# EAGLE design CAM_Board_v1 (EAGLE 9.6.2)
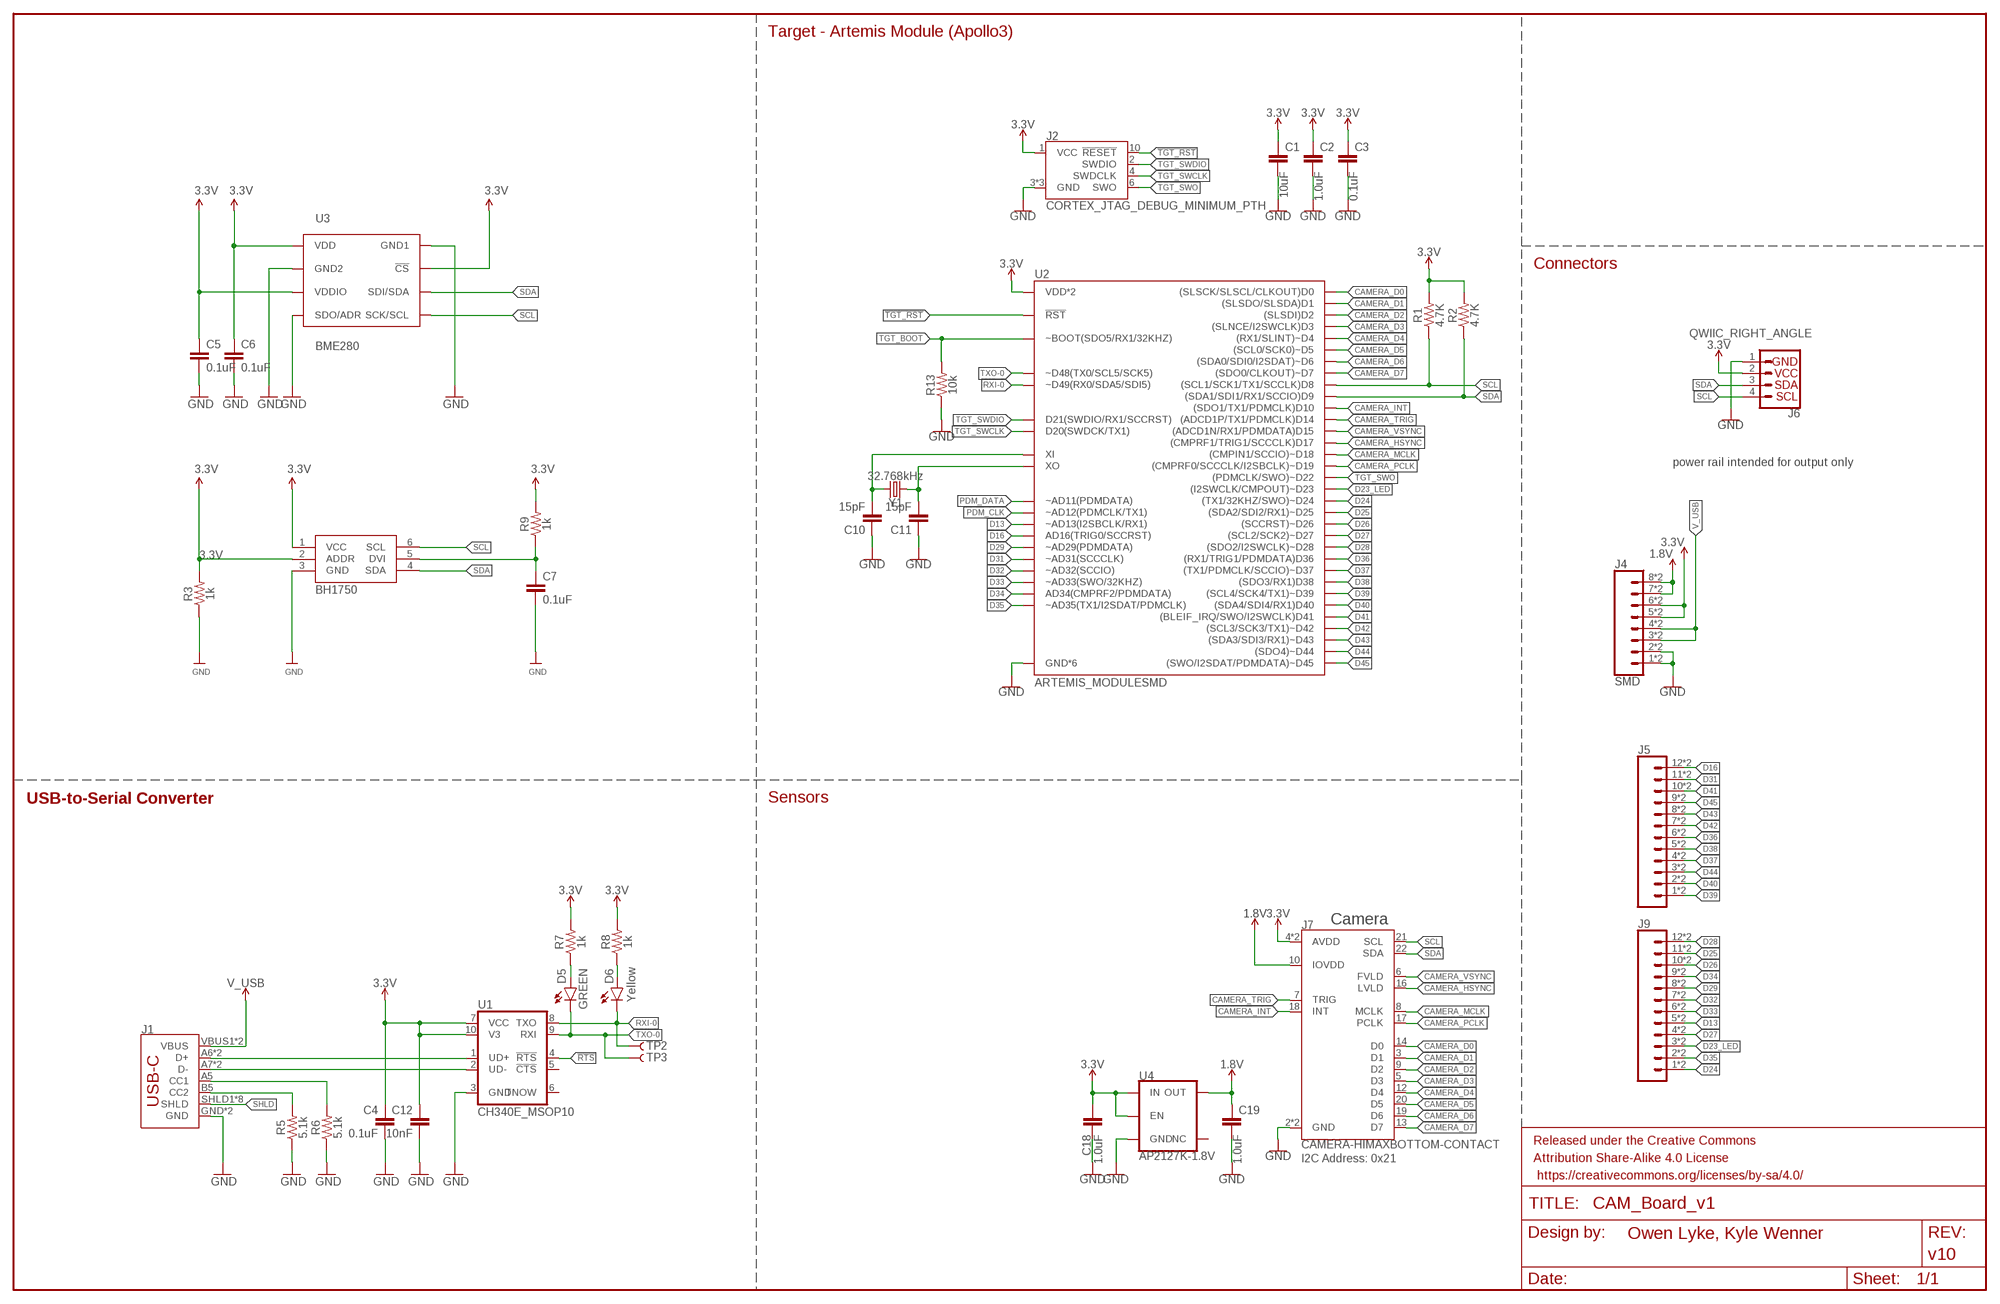
[diagram p0: schematic, sheet 1]

## Parts
C1  10uF  10UF-0603-6.3V-20%  [0603]
C2  1.0uF  1.0UF-0603-16V-10%  [0603]
C3  0.1uF  0.1UF-0603-25V-5%  [0603]
C4  0.1uF  0.1UF-0603-25V-(+80/-20%)  [0603]
C5  0.1uF  0.1UF-25V-5%(0603)  [0603-CAP]
C6  0.1uF  0.1UF-25V-5%(0603)  [0603-CAP]
C7  0.1uF  0.1UF-25V-5%(0603)  [0603-CAP]
C10  15pF  15PF-0603-50V-5%  [0603]
C11  15pF  15PF-0603-50V-5%  [0603]
C12  10nF  10NF-0603-50V-10%  [0603]
C18  1.0uF  1.0UF-0603-16V-10%  [0603]
C19  1.0uF  1.0UF-0603-16V-10%  [0603]
D5  GREEN  LED-GREEN0603  [LED-0603]
D6  Yellow  LED-YELLOW0603  [LED-0603]
FRAME1  FRAME-LEDGER  [CREATIVE_COMMONS]
IC1  BH1750  [WSOF-6]
J1  USB-C  USB_C2-LAYER  [USB-C-16P]
J2  CORTEX_JTAG_DEBUG_MINIMUM_PTH  [2X5-PTH-1.27MM]
J4  SMD  CONN_08SMD-COMBO-FEMALE  [1X08_SMD_COMBINED]
J5  CONN_12SMD_COMBINED  [1X12_SMD_COMBINED]
J6  QWIIC_RIGHT_ANGLE  QWIIC_CONNECTORJS-1MM  [JST04_1MM_RA]
J7  CAMERA-HIMAXBOTTOM-CONTACT  [FPC-24-AMPHENOL-SFV24R-1STE1HLF]
J9  CONN_12SMD_COMBINED  [1X12_SMD_COMBINED]
R1  4.7K  10KOHM-0603-1/10W-1%  [0603@1]
R2  4.7K  10KOHM-0603-1/10W-1%  [0603@1]
R3  1k  1KOHM-0603-1/10W-1%  [0603@1]
R5  5.1k  5.1KOHM5.1KOHM-0603-1/10W-1%  [0603@1]
R6  5.1k  5.1KOHM5.1KOHM-0603-1/10W-1%  [0603@1]
R7  1k  1KOHM-0603-1/10W-1%  [0603@1]
R8  1k  1KOHM-0603-1/10W-1%  [0603@1]
R9  1k  1KOHM-0603-1/10W-1%  [0603@1]
R13  10k  10KOHM-0603-1/10W-1%  [0603@1]
TP2  TEST-POINTTP_15TH_THRU  [TP_15TH]
TP3  TEST-POINTTP_15TH_THRU  [TP_15TH]
U1  CH340E_MSOP10  [MSOP10]
U2  ARTEMIS_MODULESMD  [ARTEMIS_FP]
U3  BME280  [BME280_LGA]
U4  AP2127K-1.8V  V_REG_AP2127K-1.8V  [SOT23-5]
Y1  32.768kHz  CRYSTAL-32.768KHZSMD-3.2X1.5  [CRYSTAL-SMD-3.2X1.5MM]

## Nets
1.8V: C19.1 J4.7 J4.7@2 J4.8 J4.8@2 J7.10(IOVDD) U4.5(OUT)
3.3V: C1.1 C2.1 C3.1 C4.1 C5.1 C6.1 C12.1 C18.1 IC1.1(VCC) IC1.2(ADDR) J2.1(VCC) J4.5 J4.5@2 J4.6 J4.6@2 J6.2 J7.4(AVDD) J7.11(AVDD) R1.2 R2.2 R3.2 R7.2 R8.2 R9.2 U1.7(VCC) U1.10(V3) U2.VDD@36(VDD*2) U2.VDD@37(VDD*2) U3.P$2(!CS) U3.P$6(VDDIO) U3.P$8(VDD) U4.1(IN) U4.3(EN)
!RTS: U1.4(!RTS)
!TGT_RST: J2.10(!RESET) U2.~RST(!RST)
CAMERA_D0: J7.14(D0) U2.D0((SLSCK/SLSCL/CLKOUT)D0)
CAMERA_D1: J7.3(D1) U2.D1((SLSDO/SLSDA)D1)
CAMERA_D2: J7.9(D2) U2.D2((SLSDI)D2)
CAMERA_D3: J7.5(D3) U2.D3((SLNCE/I2SWCLK)D3)
CAMERA_D4: J7.12(D4) U2.~D4((RX1/SLINT)~D4)
CAMERA_D5: J7.20(D5) U2.~D5((SCL0/SCK0)~D5)
CAMERA_D6: J7.19(D6) U2.~D6((SDA0/SDI0/I2SDAT)~D6)
CAMERA_D7: J7.13(D7) U2.D7((SDO0/CLKOUT)~D7)
CAMERA_HSYNC: J7.16(LVLD) U2.D17((CMPRF1/TRIG1/SCCCLK)D17)
CAMERA_INT: J7.18(INT) U2.D10((SDO1/TX1/PDMCLK)D10)
CAMERA_MCLK: J7.8(MCLK) U2.~D18((CMPIN1/SCCIO)~D18)
CAMERA_PCLK: J7.17(PCLK) U2.~D19((CMPRF0/SCCCLK/I2SBCLK)~D19)
CAMERA_TRIG: J7.7(TRIG) U2.D14((ADCD1P/TX1/PDMCLK)D14)
CAMERA_VSYNC: J7.6(FVLD) U2.D15((ADCD1N/RX1/PDMDATA)D15)
CC1: J1.A5(CC1) R6.2
CC2: J1.B5(CC2) R5.2
D13: J9.5 J9.5@2 U2.~AD13(~AD13(I2SBCLK/RX1))
D16: J5.12 J5.12@2 U2.AD16(AD16(TRIG0/SCCRST))
D23_LED: J9.3 J9.3@2 U2.~D23((I2SWCLK/CMPOUT)~D23)
D24: J9.1 J9.1@2 U2.~D24((TX1/32KHZ/SWO)~D24)
D25: J9.11 J9.11@2 U2.~D25((SDA2/SDI2/RX1)~D25)
D26: J9.10 J9.10@2 U2.~D26((SCCRST)~D26)
D27: J9.4 J9.4@2 U2.~D27((SCL2/SCK2)~D27)
D28: J9.12 J9.12@2 U2.~D28((SDO2/I2SWCLK)~D28)
D29: J9.8 J9.8@2 U2.~AD29(~AD29(PDMDATA))
D31: J5.11 J5.11@2 U2.~AD31(~AD31(SCCCLK))
D32: J9.7 J9.7@2 U2.~AD32(~AD32(SCCIO))
D33: J9.6 J9.6@2 U2.~AD33/SWO(~AD33(SWO/32KHZ))
D34: J9.9 J9.9@2 U2.AD34(AD34(CMPRF2/PDMDATA))
D35: J9.2 J9.2@2 U2.~AD35(~AD35(TX1/I2SDAT/PDMCLK))
D36: J5.6 J5.6@2 U2.D36((RX1/TRIG1/PDMDATA)D36)
D37: J5.4 J5.4@2 U2.~D37((TX1/PDMCLK/SCCIO)~D37)
D38: J5.5 J5.5@2 U2.D38((SDO3/RX1)D38)
D39: J5.1 J5.1@2 U2.~D39((SCL4/SCK4/TX1)~D39)
D40: J5.2 J5.2@2 U2.D40((SDA4/SDI4/RX1)D40)
D41: J5.10 J5.10@2 U2.D41((BLEIF_IRQ/SWO/I2SWCLK)D41)
D42: J5.7 J5.7@2 U2.~D42((SCL3/SCK3/TX1)~D42)
D43: J5.8 J5.8@2 U2.~D43((SDA3/SDI3/RX1)~D43)
D44: J5.3 J5.3@2 U2.~D44((SDO4)~D44)
D45: J5.9 J5.9@2 U2.~D45((SWO/I2SDAT/PDMDATA)~D45)
D+1: J1.A6(D+) J1.B6(D+) U1.1(UD+)
D-1: J1.A7(D-) J1.B7(D-) U1.2(UD-)
GND: C1.2 C2.2 C3.2 C4.2 C5.2 C6.2 C7.2 C10.1 C11.1 C12.2 C18.2 C19.2 IC1.3(GND) J1.GND J1.GND2(GND) J2.3(GND) J2.5(GND) J2.9(GND) J4.1 J4.1@2 J4.2 J4.2@2 J6.1 J7.2(GND) J7.15(GND) R3.1 R5.1 R6.1 R13.1 U1.3(GND) U2.GND@1(GND*6) U2.GND@22(GND*6) U2.GND@38(GND*6) U2.GND@39(GND*6) U2.GND@47(GND*6) U2.GND@59(GND*6) U3.P$1(GND1) U3.P$5(SDO/ADR) U3.P$7(GND2) U4.2(GND)
N$2: C7.1 IC1.5(DVI) R9.1
N$5: D5.A R7.1
N$9: D6.A R8.1
N$14: C10.2 U2.XI Y1.P$2
N$15: C11.2 U2.XO Y1.P$1
PDM_CLK: U2.~AD12(~AD12(PDMCLK/TX1))
PDM_DATA: U2.~AD11(~AD11(PDMDATA))
RXI-0: D6.C TP2.P$1 U1.8(TXO) U2.RXI-0(~D49(RX0/SDA5/SDI5))
SCL: IC1.6(SCL) J6.4 J7.21(SCL) R1.1 U2.D8((SCL1/SCK1/TX1/SCCLK)D8) U3.P$4(SCK/SCL)
SDA: IC1.4(SDA) J6.3 J7.22(SDA) R2.1 U2.D9((SDA1/SDI1/RX1/SCCIO)D9) U3.P$3(SDI/SDA)
SHLD: J1.SHLD1(SHLD) J1.SHLD2(SHLD) J1.SHLD3(SHLD) J1.SHLD4(SHLD) J1.SHLD5(SHLD) J1.SHLD6(SHLD) J1.SHLD7(SHLD) J1.SHLD8(SHLD)
TGT_BOOT: R13.2 U2.BOOT(~BOOT(SDO5/RX1/32KHZ))
TGT_SWCLK: J2.4(SWDCLK) U2.SWDCK(D20(SWDCK/TX1))
TGT_SWDIO: J2.2(SWDIO) U2.SWDIO(D21(SWDIO/RX1/SCCRST))
TGT_SWO: J2.6(SWO) U2.~D22((PDMCLK/SWO)~D22)
TXO-0: D5.C TP3.P$1 U1.9(RXI) U2.TXO-0(~D48(TX0/SCL5/SCK5))
V_USB: J1.VBUS1(VBUS) J1.VBUS2(VBUS) J4.3 J4.3@2 J4.4 J4.4@2
Unconnected: J7.MNT1@0(MNT1) J7.MNT1@1(MNT1) J7.MNT2@0(MNT2) J7.MNT2@1(MNT2) U1.5(!CTS) U1.6(TNOW) U4.4(NC)

## Notes on the sheet
- Target - Artemis Module (Apollo3)
- Connectors
- power rail intended for output only
- USB-to-Serial Converter | Sensors
- Camera
- I2C Address: 0x21

## Library data of the parts
C1 = SparkFun-Capacitors:10UF: 10.0µF ceramic capacitors A capacitor is a passive two-terminal electrical component used to store electrical energy temporarily in an electric field.; PROD_ID: CAP-11015
C2 C18 C19 = SparkFun-Capacitors:1.0UF: 1µF ceramic capacitors A capacitor is a passive two-terminal electrical component used to store electrical energy temporarily in an electric field.; PROD_ID: CAP-00868
C3 = SparkFun-Capacitors:0.1UF: 0.1µF ceramic capacitors A capacitor is a passive two-terminal electrical component used to store electrical energy temporarily in an electric field.; PROD_ID: CAP-08604
C4 = SparkFun-Capacitors:0.1UF: 0.1µF ceramic capacitors A capacitor is a passive two-terminal electrical component used to store electrical energy temporarily in an electric field.; PROD_ID: CAP-00810
C5-C7 = SparkFun-Capacitors:0.1UF-25V-5%(0603): CAP-08604; PROD_ID: CAP-08604
C10 C11 = SparkFun-Capacitors:15PF: 15pF ceramic capacitors A capacitor is a passive two-terminal electrical component used to store electrical energy temporarily in an electric field.; PROD_ID: CAP-07881
C12 = SparkFun-Capacitors:10NF: 0.01uF/10nF/10,000pF ceramic capacitors A capacitor is a passive two-terminal electrical component used to store electrical energy temporarily in an electric field. CAP-09321; PROD_ID: CAP-00867
D5 = SparkFun-LED:LED-GREEN: Green SMD LED Used in manufacturing of various products at SparkFun Packages: 0603 - SMD 0603 package [Product Link] <http://www.futureelectronics.com/en/technologies/semiconductors/optoelectronics/leds/Pages/9894312-LTST-C190GKT.aspx?CrossPart=HSMG-C190&IM=0> LilyPad 1206 - SMD1206 LilyPad package [Product Link] <http://www.futureelectronics.com/en/Technologies/Product.aspx?ProductID=IN150NGHARVATEKCORPORATION2049943&IM=0> 1206 - SMD1206 package [Product Link] <http://www.futureelectronics.com/en/technologies/semiconductors/optoelectronics/leds/Pages/8315665-LTST-C150KGKT.aspx?IM=0> 1206 Bottom Mount -SMD 1206 Bottom Mount [Product Link] <http://www.digikey.com/product-detail/en/lite-on-inc/LTST-C230KGKT/160-1456-1-ND/386854> SparkFun Products: Pro Mini 328 -5V <https://www.sparkfun.com/products/821> RedBoard <https://www.sparkfun.com/products/12757> MP3 Trigger <https://www.sparkfun.com/products/13720> Makey Makey <https://www.sparkfun.com/products/11076>; PROD_ID: DIO-00821
D6 = SparkFun-LED:LED-YELLOW: Yellow SMD LED Used in manufacturing several products at SparkFun. Packages: 0603 - SMD 0603 package[Product Link] <http://www.kingbrightusa.com/product.asp?catalog_name=LED&product_id=APT1608SYCK> 0603 -SMART - SMART SMD 0603 package (more efficient/more expensive) [Product Link] <http://www.osram-os.com/osram_os/en/products/product-catalog/led-light-emitting-diodes/smartled-0603/ly-l29k/index.jsp> LilyPad - SMD1206 package[Product Datasheet] <https://www.sparkfun.com/datasheets/DevTools/LilyPad/Q150YUS4.pdf> SparkFun Products: Blynk Board <https://www.sparkfun.com/products/13794> IOIO-OTG <https://www.sparkfun.com/products/13613> XBee Explorer Serial <https://www.sparkfun.com/products/13225>; PROD_ID: DIO-09003
FRAME1 = SparkFun-Aesthetics:FRAME-LEDGER: Schematic Frame - Ledger Standard 11x14 US Ledger frame; DESIGNER: Owen Lyke, Kyle Wenner; REV: v10
IC1 = microbuilder:BH1750
J1 = SparkFun-Connectors:USB_C: USB Type C 16Pin Connector Super Speed pins not available on the 16-pin purely SMD connector so this part is best for USB 2.0 implementations. D1 and D2 are tied together enabling D+/- no matter which way the cable is plugged into the connector. The two channel configuration pins (CC1/2) are exposed. These are normally connected to ground via 5.1k resistors but can be reconfigured for high current/high power applications.; PROD_ID: CONN-14122
J2 = SparkFun-Connectors:CORTEX_JTAG_DEBUG_MINIMUM: Cortex Debug Connector - 10 pin Supports JTAG debug, Serial Wire debug, and Serial Wire Viewer. PTH and SMD connector options available. General Connector Information <http://infocenter.arm.com/help/topic/com.arm.doc.faqs/attached/13634/cortex_debug_connectors.pdf> Products: PTH Connector <http://www.digikey.com/product-detail/en/cnc-tech/3220-10-0100-00/1175-1627-ND/3883661> -via Digi-Key SparkFun PSoc <https://www.sparkfun.com/products/13229> SparkFun T <https://www.sparkfun.com/products/13810>
J4 = SparkFun-Connectors:CONN_08: Multi connection point. Often used as Generic Header-pin footprint for 0.1 inch spaced/style header connections On any of the 0.1 inch spaced packages, you can populate with these: Break Away Headers - Straight <https://www.sparkfun.com/products/116> (PRT-00116) Break Away Male Headers - Right Angle <https://www.sparkfun.com/products/553> (PRT-00553) Female Headers <https://www.sparkfun.com/products/115> (PRT-00115) Break Away Headers - Machine Pin <https://www.sparkfun.com/products/117> (PRT-00117) Break Away Female Headers - Swiss Machine Pin <https://www.sparkfun.com/products/743> (PRT-00743) Arduino Stackable Header - 8 Pin <https://www.sparkfun.com/products/9279> (PRT-09279) For SCREWTERMINALS and SPRING TERMINALS visit here: Screw Terimnals on SparkFun.com <https://www.sparkfun.com/search/results?term=Screw+Terminals> (5mm/3.5mm/2.54mm spacing) This device is also useful as a general connection point to wire up your design to another part of your project. Our various solder wires solder well into these plated through hole pads. Hook-Up Wire - Assortment (Stranded, 22 AWG) <https://www.sparkfun.com/products/11375> (PRT-11375) Hook-Up Wire - Assortment (Solid Core, 22 AWG) <https://www.sparkfun.com/products/11367> (PRT-11367) View the entire wire category on our website here <https://www.sparkfun.com/categories/141> Special notes: Molex polarized connector foot print use with SKU : PRT-08231 with associated crimp pins and housings. 1MM SMD Version SKU: PRT-10208 NOTES ON THE VARIANTS LOCK and LOCK_LONGPADS... This footprint was designed to help hold the alignment of a through-hole component (i.e. 6-pin header) while soldering it into place. You may notice that each hole has been shifted either up or down by 0.005 of an inch from it's more standard position (which is a perfectly straight line). This slight alteration caused the pins (the squares in the middle) to touch the edges of the holes. Because they are alternating, it causes a "brace" to hold the component in place. 0.005 has proven to be the perfect amount of "off-center" position when using our standard breakaway headers. Although looks a little odd when you look at the bare footprint, once you have a header in there, the alteration is very hard to notice. Also,if you push a header all the way into place, it is covered up entirely on the bottom side.; PROD_ID: CONN-10204; SF_ID: PRT-11543
J5 J9 = SparkFun-Connectors:CONN_12: Multi connection point. Often used as Generic Header-pin footprint for 0.1 inch spaced/style header connections On any of the 0.1 inch spaced packages, you can populate with these: Break Away Headers - Straight <https://www.sparkfun.com/products/116> (PRT-00116) Break Away Male Headers - Right Angle <https://www.sparkfun.com/products/553> (PRT-00553) Female Headers <https://www.sparkfun.com/products/115> (PRT-00115) Break Away Headers - Machine Pin <https://www.sparkfun.com/products/117> (PRT-00117) Break Away Female Headers - Swiss Machine Pin <https://www.sparkfun.com/products/743> (PRT-00743) For SCREWTERMINALS and SPRING TERMINALS visit here: Screw Terimnals on SparkFun.com <https://www.sparkfun.com/search/results?term=Screw+Terminals> (5mm/3.5mm/2.54mm spacing) This device is also useful as a general connection point to wire up your design to another part of your project. Our various solder wires solder well into these plated through hole pads. Hook-Up Wire - Assortment (Stranded, 22 AWG) <https://www.sparkfun.com/products/11375> (PRT-11375) Hook-Up Wire - Assortment (Solid Core, 22 AWG) <https://www.sparkfun.com/products/11367> (PRT-11367) View the entire wire category on our website here <https://www.sparkfun.com/categories/141> Special notes: Molex polarized connector foot print use with SKU : PRT-08231 with associated crimp pins and housings. 1MM SMD Version SKU: PRT-10208 NOTES ON THE VARIANTS LOCK and LOCK_LONGPADS... This footprint was designed to help hold the alignment of a through-hole component (i.e. 6-pin header) while soldering it into place. You may notice that each hole has been shifted either up or down by 0.005 of an inch from it's more standard position (which is a perfectly straight line). This slight alteration caused the pins (the squares in the middle) to touch the edges of the holes. Because they are alternating, it causes a "brace" to hold the component in place. 0.005 has proven to be the perfect amount of "off-center" position when using our standard breakaway headers. Although looks a little odd when you look at the bare footprint, once you have a header in there, the alteration is very hard to notice. Also,if you push a header all the way into place, it is covered up entirely on the bottom side.; PROD_ID: CONN-15197
J6 = SparkFun-Connectors:QWIIC_CONNECTOR: SparkFun I2C Standard Qwiic Connector An SMD 1mm pitch JST connector makes it easy and quick (get it? Qwiic?) to connect I2C devices to each other. The Qwiic system <http://www.sparkfun.com/qwiic> enables fast and solderless connection between popular platforms and various sensors and actuators. We carry 200mm <https://www.sparkfun.com/products/14204>, 100mm <https://www.sparkfun.com/products/14205>, 50mm <https://www.sparkfun.com/products/14206>, and breadboard friendly <https://www.sparkfun.com/products/14207> Qwiic cables. We also offer 10 pcs strips <https://www.sparkfun.com/products/14323> the SMD connectors.; PROD_ID: CONN-13694
J7 = SparkFun-Connectors:CAMERA-HIMAX; DIGIKEY: 609-4320-2-ND; PROD_ID: CONN-14233
R1 R2 = SparkFun-Resistors:10KOHM: 10kΩ resistor A resistor is a passive two-terminal electrical component that implements electrical resistance as a circuit element. Resistors act to reduce current flow, and, at the same time, act to lower voltage levels within circuits. - Wikipedia; PROD_ID: RES-00824; VALUE: 10k
R3 R7-R9 = SparkFun-Resistors:1KOHM: 1kΩ resistor A resistor is a passive two-terminal electrical component that implements electrical resistance as a circuit element. Resistors act to reduce current flow, and, at the same time, act to lower voltage levels within circuits. - Wikipedia; PROD_ID: RES-07856
R5 R6 = SparkFun-Resistors:5.1KOHM; PROD_ID: RES-12083
R13 = SparkFun-Resistors:10KOHM: 10kΩ resistor A resistor is a passive two-terminal electrical component that implements electrical resistance as a circuit element. Resistors act to reduce current flow, and, at the same time, act to lower voltage levels within circuits. - Wikipedia; PROD_ID: RES-00824
TP2 TP3 = SparkFun-Connectors:TEST-POINT: SparkFun Test Points Bare copper test points for troubleshooting or In-Circuit-Testing. These are used by our Production team for verifying production board runs using pogo-pins on test beds. SparkFun Products: SparkFun LSM9DS1 Breakout <https://www.sparkfun.com/products/13284> SparkFun PSOC <https://www.sparkfun.com/products/13714> SparkFun Load Cell Amplifier <https://www.sparkfun.com/products/13879>
U1 = SparkFun-IC-Comms:CH340E; PROD_ID: IC-14135
U2 = SparkFun-IC-Microcontroller:ARTEMIS_MODULE: Description: The Artemis Module from SparkFun is a Cortex-M4F with BLE 5.0 running up to 96MHz and with as low power as 6uA per MHz (less than 5mW). This is the world's first module to bridge the market between hobbyists and consumer products. We've packaged all the power of a modern microcontroller into a module that is both extremely easy to use but is mass-market ready. The flexibility of the Artemis module starts with our [Arduino core](https://github.com/sparkfun/Arduino_Apollo3). You can program and use the Artemis module just like you would an Uno or any other Arduino. Time to first blink is just 5 minutes away! We built the core from the ground up, making it fast and as light weight as possible.; PROD_ID: SUB-14479
U3 = BME280ComponentLibrary:BME280; PROD_ID: IC-13090
U4 = SparkFun-IC-Power:V_REG_AP2127: AP2127 - 300mA CMOS LDO Regulator w/ Enable The AP2127 is CMOS process low dropout linear regulator with enable function, the regulator delivers a guaranteed 300mA (min.) continuous load current. Features Output Voltage Accuracy: ±1.5% Output Current: 300mA (Min.) Foldback Short Current Protection: 50mA Enable Function to Turn ON/OFF VOUT Low Dropout Voltage (3.3V): 250mV (Typ.) @IOUT=600mA Excellent Load Regulation: 0.2%/A (Typ.) Excellent Line Regulation: 0.02%/V (Typ.) Low Quiescent Current: 55μA (Typ.) Low Standby Current: 0.01μA (Typ.) Low Output Noise: 50μVRMS PSRR: 100Hz -65dB, 1kHz -65dB OTSD Protection Stable with 1.0μF Flexible Cap: Ceramic, Tantalum and Aluminum Electrolytic Operation Temperature Range: -40°C to 85°C ESD: MM 400V, HBM 4000V; PROD_ID: VREG-14239
Y1 = SparkFun-Clocks:CRYSTAL-32.768KHZ: 32.768kHz Crystal Frequency: 32.768kHz Frequency Stability: ±20ppm Load Capacitance: 12.5pF (PTH-2X6 & SMD-3.2X1.5), 6pF (SMD-2X6) SparkFun Products: SparkFun BigTime Watch Kit <https://www.sparkfun.com/products/11734> SparkFun nRF52832 Breakout <https://www.sparkfun.com/products/13990> SparkFun Real Time Clock Module <https://www.sparkfun.com/products/12708>; PROD_ID: XTAL-13062

## Net classes
1 highpower: width 0.406 mm, drill 0.483 mm
2 lowpower: width 0.305 mm, drill 0.483 mm

## Board
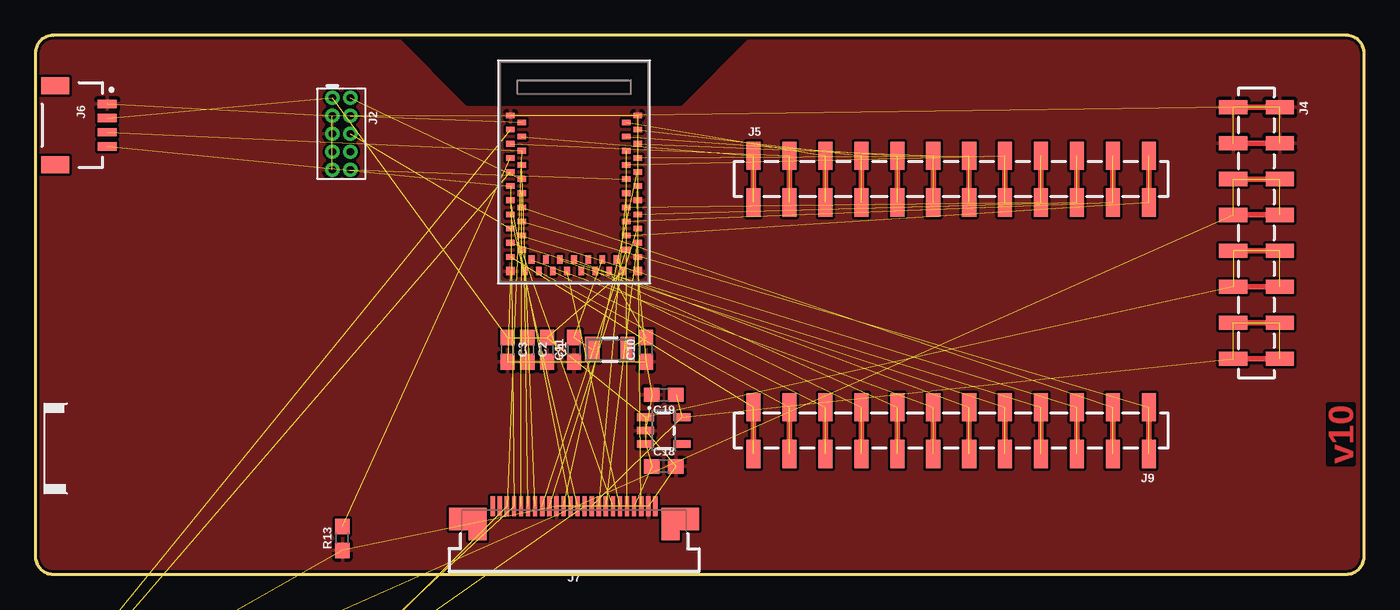
[diagram p1: board, top side]
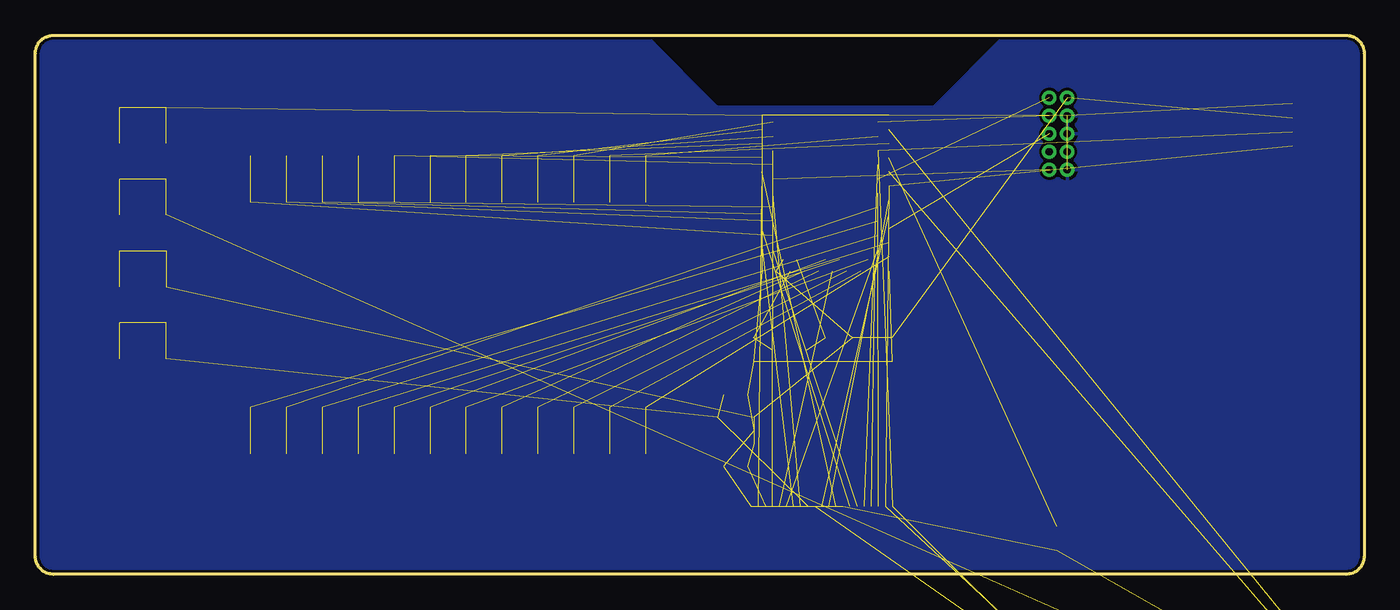
[diagram p2: board, bottom side, seen from below]

Size 93.98 x 38.1 mm. Coordinates in mm from the lower left corner, seen from the top.
Outline: 92.71,38.1 1.27,38.1 arc90 0,36.83 0,1.27 arc90 1.27,0 92.71,0 arc90 93.98,1.27 93.98,36.83 arc90 92.71,38.1
Copper layers (1*16): Top 0.035mm / dielectric 1.5mm / Bottom 0.035mm
Design rules "SparkFun-2-layer-FAB-LIMIT": minimum track width 4mil, minimum drill 6mil, track to track 4mil, track to pad 4mil, pad to pad 4mil, via to via 4mil, smd to smd 4mil, copper to edge 4mil, drill to drill 4mil, minimum pad ring 5mil, minimum via ring 5mil, stop-mask expansion 4mil, vias tented up to drill 25mil, thermal gap 10mil

### Footprints (pad centres in the part's own frame; a part is rotated, then mirrored left to right if it is on the bottom)
0603 = smd 1.1 x 1: 1 -0.85,0; 2 0.85,0
0603-CAP = smd 1.1 x 1: 1 -0.85,0; 2 0.85,0
LED-0603 = smd 1 x 1: A -0.877,0; C 0.877,0
WSOF-6 = smd 0.55 x 0.25: 1 -1.375,0.5; 2 -1.375,0; 3 -1.375,-0.5; 4 1.375,-0.5; 5 1.375,0; 6 1.375,0.5
USB-C-16P = smd 0.3 x 1.016: A5 -1.25,0.154; A6 -0.25,0.154; A7 0.25,0.154; A8 1.25,0.154; B5 1.75,0.154; B6 0.75,0.154; B7 -0.75,0.154; B8 -1.75,0.154 | smd 0.6 x 1.016: GND -3.225,0.154; GND2 3.225,0.154 | smd 1 x 2.1: SHLD1 -4.32,-0.915; SHLD2 4.32,-0.915 | smd 1 x 2.1 bottom: SHLD3 -4.32,-0.915; SHLD4 4.32,-0.915 | smd 1 x 1.6: SHLD5 -4.32,-5.095; SHLD8 4.32,-5.095 | smd 1 x 1.6 bottom: SHLD6 -4.32,-5.095; SHLD7 4.32,-5.095 | smd 0.55 x 1.016: VBUS1 -2.45,0.154; VBUS2 2.45,0.154 | hole 0.65: -2.89,-1.445; 2.89,-1.445
2X5-PTH-1.27MM = drill 0.508 pad 1: 1 -2.54,-0.635; 2 -2.54,0.635; 3 -1.27,-0.635; 4 -1.27,0.635; 5 0,-0.635; 6 0,0.635; 7 1.27,-0.635; 8 1.27,0.635; 9 2.54,-0.635; 10 2.54,0.635
1X08_SMD_COMBINED = smd 1 x 2: 1 0,1.65; 1@2 0,-1.65; 2 2.54,-1.65; 2@2 2.54,1.65; 3 5.08,1.65; 3@2 5.08,-1.65; 4 7.62,-1.65; 4@2 7.62,1.65; 5 10.16,1.65; 5@2 10.16,-1.65; 6 12.7,-1.65; 6@2 12.7,1.65; 7 15.24,1.65; 7@2 15.24,-1.65; 8 17.78,-1.65; 8@2 17.78,1.65
1X12_SMD_COMBINED = smd 1 x 2: 1 0,1.65; 1@2 0,-1.65; 2 2.54,-1.65; 2@2 2.54,1.65; 3 5.08,1.65; 3@2 5.08,-1.65; 4 7.62,-1.65; 4@2 7.62,1.65; 5 10.16,1.65; 5@2 10.16,-1.65; 6 12.7,-1.65; 6@2 12.7,1.65; 7 15.24,1.65; 7@2 15.24,-1.65; 8 17.78,-1.65; 8@2 17.78,1.65; 9 20.32,1.65; 9@2 20.32,-1.65; 10 22.86,-1.65; 10@2 22.86,1.65; 11 25.4,1.65; 11@2 25.4,-1.65; 12 27.94,-1.65; 12@2 27.94,1.65
JST04_1MM_RA = smd 0.6 x 1.35: 1 -1.5,0; 2 -0.5,0; 3 0.5,0; 4 1.5,0 | smd 1.2 x 2: NC1 2.8,-3.675; NC2 -2.8,-3.675
FPC-24-AMPHENOL-SFV24R-1STE1HLF = smd 0.3 x 1.4: 1 5.75,2.4; 2 5.25,2.4; 3 4.75,2.4; 4 4.25,2.4; 5 3.75,2.4; 6 3.25,2.4; 7 2.75,2.4; 8 2.25,2.4; 9 1.75,2.4; 10 1.25,2.4; 11 0.75,2.4; 12 0.25,2.4; 13 -0.25,2.4; 14 -0.75,2.4; 15 -1.25,2.4; 16 -1.75,2.4; 17 -2.25,2.4; 18 -2.75,2.4; 19 -3.25,2.4; 20 -3.75,2.4; 21 -4.25,2.4; 22 -4.75,2.4; 23 -5.25,2.4; 24 -5.75,2.4 | smd 1.4 x 1.6: MNT1@0 -8.15,1.5; MNT2@1 8.15,1.5 | smd 1.25 x 2.3: MNT1@1 -6.825,1.15; MNT2@0 6.825,1.15
0603@1 = smd 1.1 x 1: 1 -0.85,0; 2 0.85,0
TP_15TH = drill 0.381 pad 0.61: P$1 0,0
MSOP10 = smd 1 x 0.3: 1 -2.25,1; 2 -2.25,0.5; 3 -2.25,0; 4 -2.25,-0.5; 5 -2.25,-1; 6 2.25,-1; 7 2.25,-0.5; 8 2.25,0; 9 2.25,0.5; 10 2.25,1
ARTEMIS_FP = smd 0.4 x 0.6: AD16 -4,-3.7; BOOT 1.5,4.5; D0 0.5,-4.5; D1 -0.5,-4.5; D2 -1,-3.7; D3 2,-3.7; D7 -1.5,4.5; D8 -0.5,4.5; D9 2,3.7; D10 1,3.7; D14 -5,3.7; D17 -3.5,-4.5; D36 2.5,-4.5; D38 3,-3.7; D40 2.5,4.5; D41 -2.5,-4.5; GND@1 4.5,4.5; GND@39 -5.5,-4.5; GND@47 -1.5,-4.5; GND@59 4.5,-4.5; RXI-0 3.5,4.5; SWDCK 4,3.7; SWDIO 0,3.7; TXO-0 0.5,4.5; ~AD31 -3,-3.7; ~AD35 -2,3.7; ~D4 -2.5,4.5; ~D5 -1,3.7; ~D18 -4.5,-4.5; ~D19 -5,-3.7; ~D22 -3.5,4.5; ~D23 -4,3.7; ~D24 -3,3.7; ~D27 -4.5,4.5; ~D28 -5.5,4.5; ~D37 3.5,-4.5; ~D39 3,3.7; ~D42 1.5,-4.5; ~D43 1,-3.7; ~D44 4,-3.7; ~D45 -2,-3.7; ~RST 0,-3.7 | smd 0.6 x 0.4: AD34 -6.5,-0.5; D15 -6.5,0.5; VDD@36 -5.7,-3; VDD@37 -6.5,-3.5; XI -6.5,-2.5; XO -5.7,-2; ~AD11 -5.7,-1; ~AD12 -5.7,2; ~AD13 -5.7,1; ~AD29 -6.5,-1.5; ~AD32 -5.7,3; ~AD33/SWO -5.7,0; ~D6 -6.5,3.5; ~D25 -6.5,2.5; ~D26 -6.5,1.5 | smd 0.6 x 0.6: GND@22 -6.5,4.5; GND@38 -6.5,-4.5
BME280_LGA = smd 0.5 x 0.35: P$1 1.025,0.975; P$2 1.025,0.325; P$3 1.025,-0.325; P$4 1.025,-0.975; P$5 -1.025,-0.975; P$6 -1.025,-0.325; P$7 -1.025,0.325; P$8 -1.025,0.975
SOT23-5 = smd 0.55 x 1.2: 1 -0.95,-1.3; 2 0,-1.3; 3 0.95,-1.3; 4 0.95,1.3; 5 -0.95,1.3
CRYSTAL-SMD-3.2X1.5MM = smd 1 x 1.8: P$1 -1.25,0; P$2 1.25,0

### Placement (x,y rotation side)
C1  36.2,15.88 270 top
C2  34.8,15.88 270 top
C3  33.4,15.88 270 top
C4  -12.7,-29.21 0 top  (outside the outline)
C5  -15.24,-67.31 0 top  (outside the outline)
C6  -26.67,-72.39 0 top  (outside the outline)
C7  -26.67,-110.49 0 top  (outside the outline)
C10  43.18,15.88 90 top
C11  38.1,15.88 90 top
C12  -8.89,-29.21 0 top  (outside the outline)
C18  44.45,7.62 0 top
C19  44.45,12.7 180 top
D5  -17.78,-39.37 0 top  (outside the outline)
D6  -21.59,-39.37 0 top  (outside the outline)
FRAME1  24.13,-16.51 0 top  (outside the outline)
IC1  -25.4,-93.98 0 top  (outside the outline)
J1  -17.78,-19.05 0 top  (outside the outline)
J2  21.64,31.14 270 top
J4  86.36,33.02 270 top
J5  50.8,27.94 0 top
J6  5.08,31.75 270 top
J7  38.1,2.41 0 top
J9  78.74,10.16 180 top
R1  -26.67,-52.07 0 top  (outside the outline)
R2  -26.67,-55.88 0 top  (outside the outline)
R3  -25.4,-114.3 0 top  (outside the outline)
R5  -21.59,-35.56 0 top  (outside the outline)
R6  -17.78,-35.56 0 top  (outside the outline)
R7  -13.97,-35.56 0 top  (outside the outline)
R8  -10.16,-35.56 0 top  (outside the outline)
R9  -25.4,-106.68 0 top  (outside the outline)
R13  21.72,2.54 90 top
TP2  -13.97,-39.37 0 top  (outside the outline)
TP3  -11.43,-39.37 0 top  (outside the outline)
U1  -19.05,-30.48 0 top  (outside the outline)
U2  38.1,27.94 90 top
U3  -25.4,-62.23 0 top  (outside the outline)
U4  44.45,10.16 270 top
Y1  40.64,15.88 0 top

### Tracks (layer width: path | path; a pad name or v marks a point on that pad's centre or on a via)
1.8V  (6 unrouted)
3.3V  (32 unrouted)
!TGT_RST  (1 unrouted)
CAMERA_D0  (1 unrouted)
CAMERA_D1  (1 unrouted)
CAMERA_D2  (1 unrouted)
CAMERA_D3  (1 unrouted)
CAMERA_D4  (1 unrouted)
CAMERA_D5  (1 unrouted)
CAMERA_D6  (1 unrouted)
CAMERA_D7  (1 unrouted)
CAMERA_HSYNC  (1 unrouted)
CAMERA_INT  (1 unrouted)
CAMERA_MCLK  (1 unrouted)
CAMERA_PCLK  (1 unrouted)
CAMERA_TRIG  (1 unrouted)
CAMERA_VSYNC  (1 unrouted)
CC1  (1 unrouted)
CC2  (1 unrouted)
D13  (2 unrouted)
D16  (2 unrouted)
D23_LED  (2 unrouted)
D24  (2 unrouted)
D25  (2 unrouted)
D26  (2 unrouted)
D27  (2 unrouted)
D28  (2 unrouted)
D29  (2 unrouted)
D31  (2 unrouted)
D32  (2 unrouted)
D33  (2 unrouted)
D34  (2 unrouted)
D35  (2 unrouted)
D36  (2 unrouted)
D37  (2 unrouted)
D38  (2 unrouted)
D39  (2 unrouted)
D40  (2 unrouted)
D41  (2 unrouted)
D42  (2 unrouted)
D43  (2 unrouted)
D44  (2 unrouted)
D45  (2 unrouted)
D+1  (2 unrouted)
D-1  (2 unrouted)
GND  (39 unrouted)
  pour Top (isolate 0.203): 0,38.1 25.4,38.1 30.48,33.02 45.72,33.02 50.8,38.1 93.98,38.1 93.98,0 0,0
  pour Bottom (isolate 0.203): 0,38.1 25.4,38.1 30.48,33.02 45.72,33.02 50.8,38.1 93.98,38.1 93.98,0 0,0
N$2  (2 unrouted)
N$5  (1 unrouted)
N$9  (1 unrouted)
N$14  (2 unrouted)
N$15  (2 unrouted)
RXI-0  (3 unrouted)
SCL  (5 unrouted)
SDA  (5 unrouted)
SHLD  (7 unrouted)
TGT_BOOT  (1 unrouted)
TGT_SWCLK  (1 unrouted)
TGT_SWDIO  (1 unrouted)
TGT_SWO  (1 unrouted)
TXO-0  (3 unrouted)
V_USB  (5 unrouted)

### Text on the board
Top: v10
tDocu: Owen Lyke, Kyle Wenner